# EasyEDA Pro project ProDoc_Board2_2025-10-18.epro

# Schematic Schematic2
Board Name: Board2; Create Date: 2025-10-17; Page Name: P1; Project Name: 日历_2025-10-14_18-41-31; Schematic Name: Schematic2; Update Date: 2025-10-18; Company: 嘉立创EDA; Page Size: B; Version: V1.0
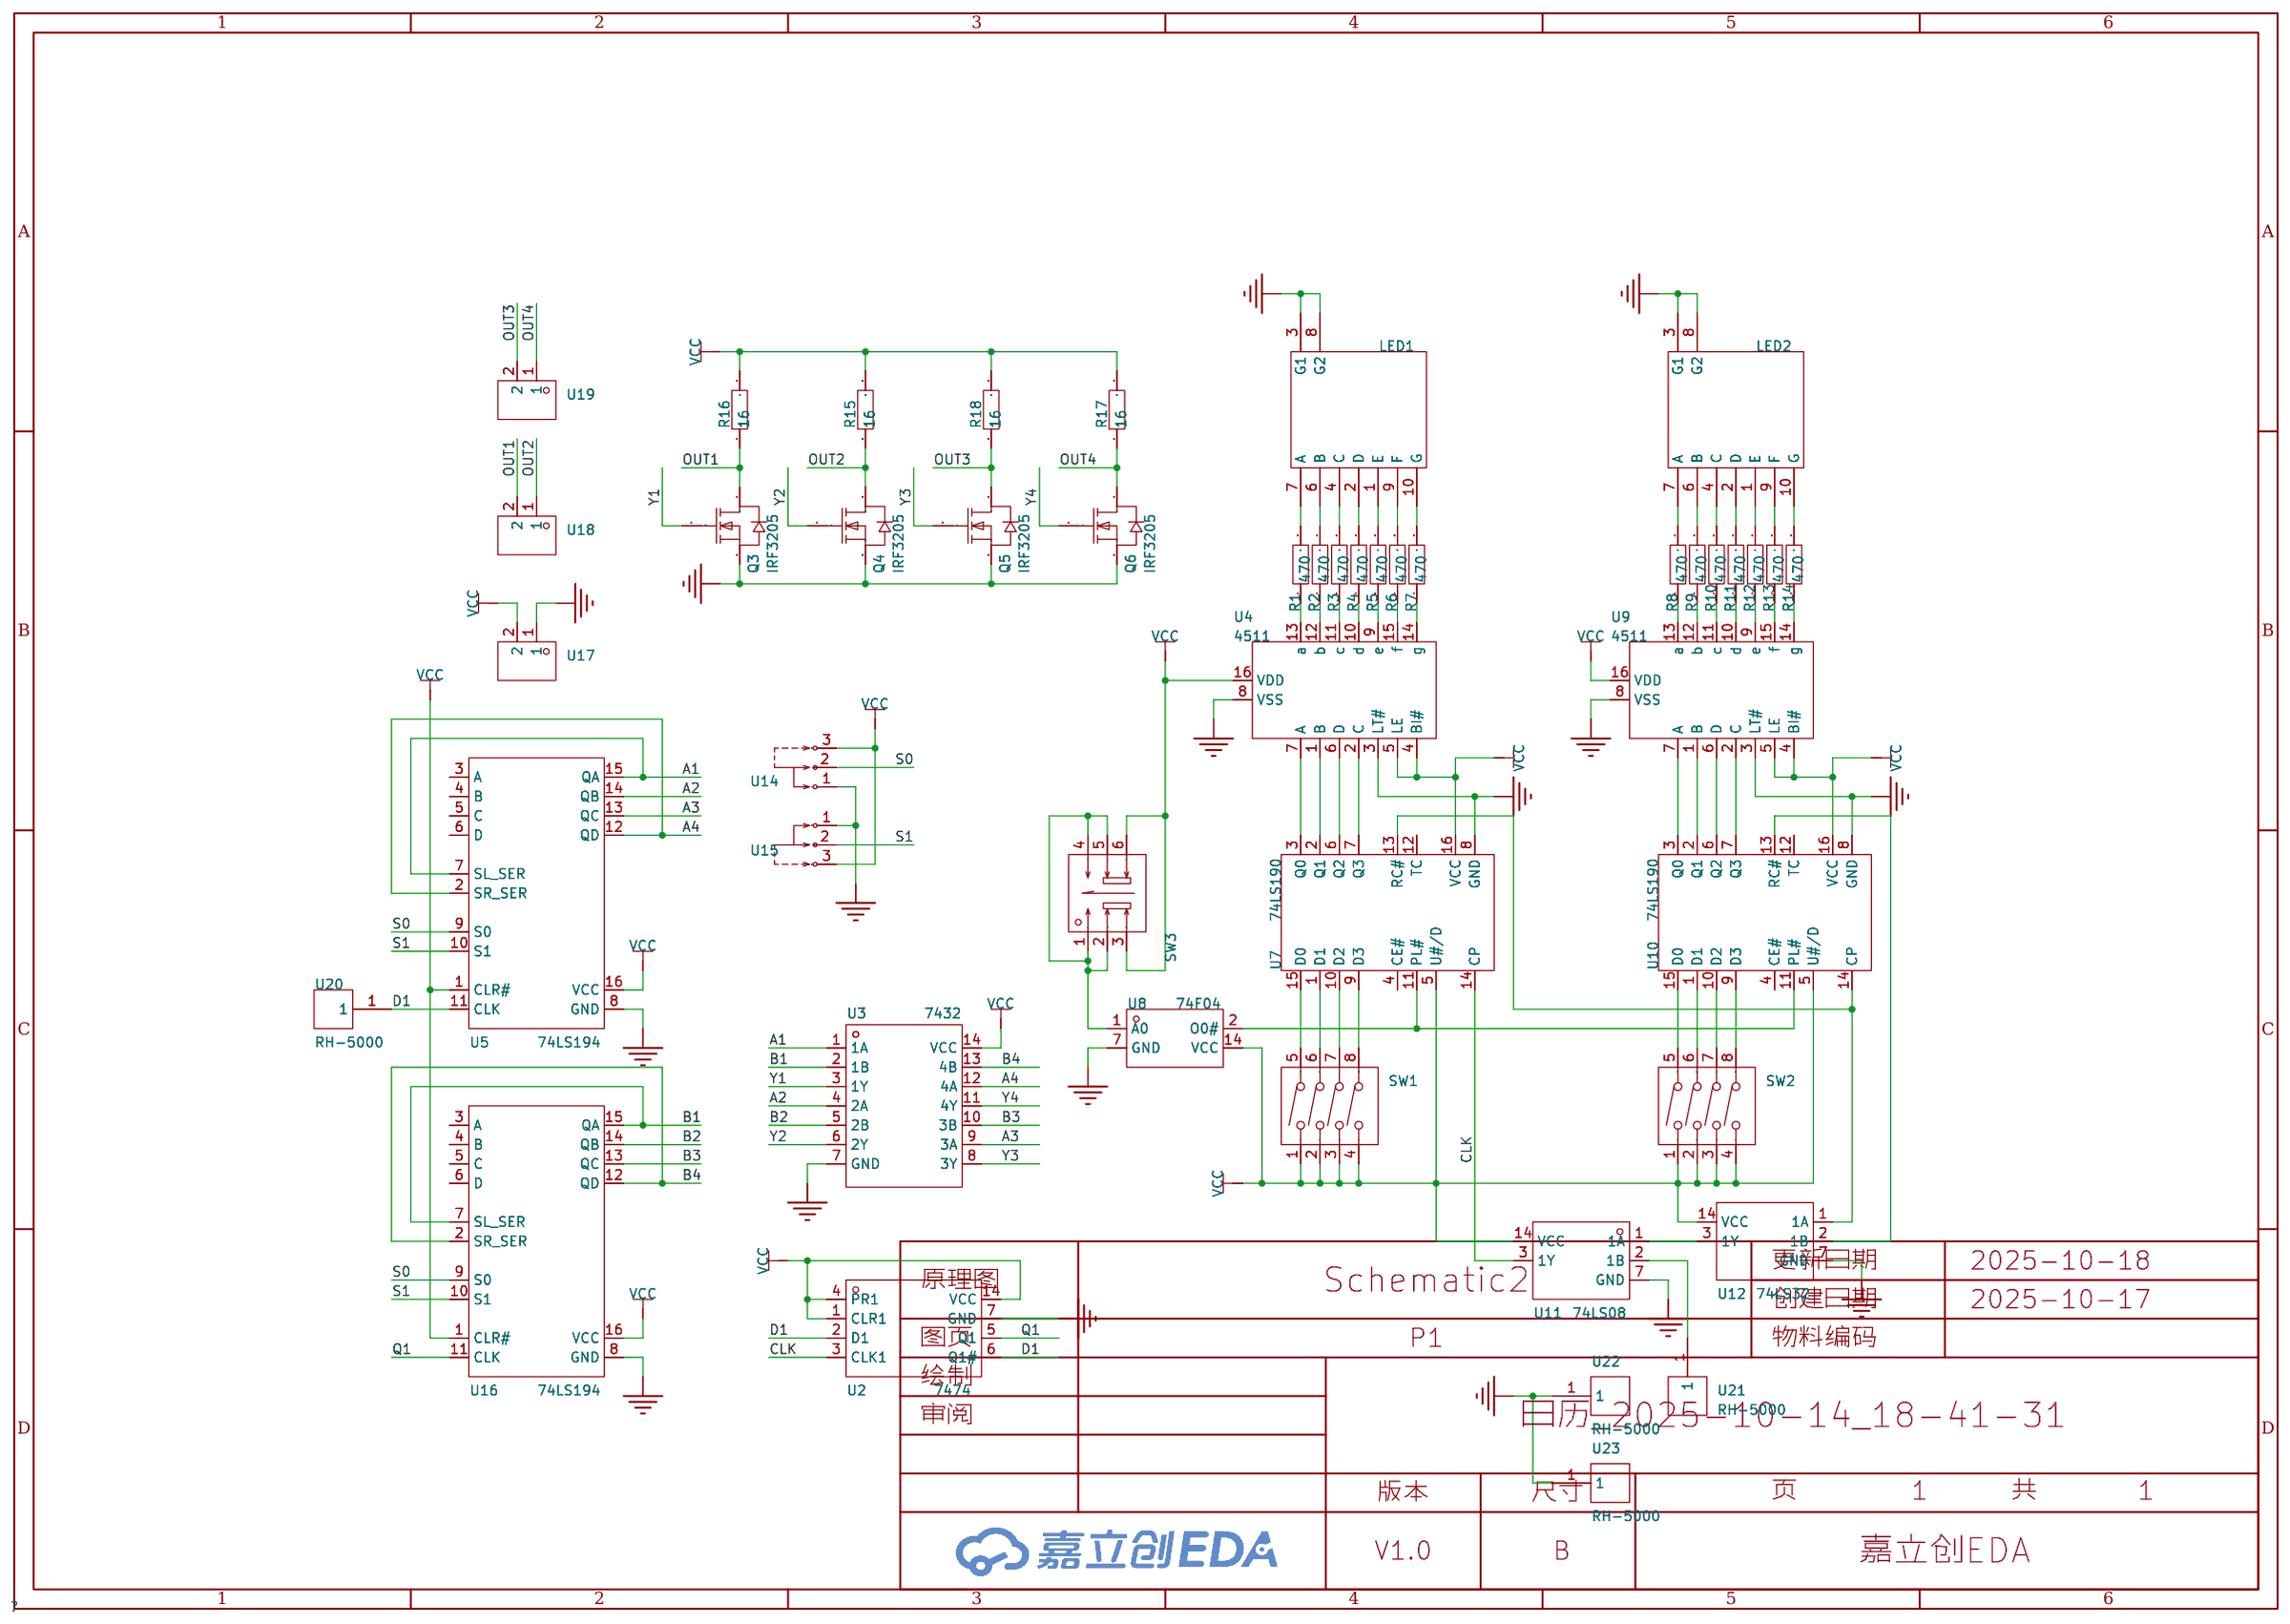
[diagram p0: schematic sheet]

## Parts
LED1  FJ5161AH  [LED-SEG-TH_10P-L12.6-W19.0-P2.54-S15.24-BL]
LED2  FJ5161AH  [LED-SEG-TH_10P-L12.6-W19.0-P2.54-S15.24-BL]
Q3  IRF3205  [TO-220-3_L10.0-W4.5-P2.54-L]
Q4  IRF3205  [TO-220-3_L10.0-W4.5-P2.54-L]
Q5  IRF3205  [TO-220-3_L10.0-W4.5-P2.54-L]
Q6  IRF3205  [TO-220-3_L10.0-W4.5-P2.54-L]
R1  470  [RES-TH_BD2.5-L6.5-P10.50-D0.6]
R2  470  [RES-TH_BD2.5-L6.5-P10.50-D0.6]
R3  470  [RES-TH_BD2.5-L6.5-P10.50-D0.6]
R4  470  [RES-TH_BD2.5-L6.5-P10.50-D0.6]
R5  470  [RES-TH_BD2.5-L6.5-P10.50-D0.6]
R6  470  [RES-TH_BD2.5-L6.5-P10.50-D0.6]
R7  470  [RES-TH_BD2.5-L6.5-P10.50-D0.6]
R8  470  [RES-TH_BD2.5-L6.5-P10.50-D0.6]
R9  470  [RES-TH_BD2.5-L6.5-P10.50-D0.6]
R10  470  [RES-TH_BD2.5-L6.5-P10.50-D0.6]
R11  470  [RES-TH_BD2.5-L6.5-P10.50-D0.6]
R12  470  [RES-TH_BD2.5-L6.5-P10.50-D0.6]
R13  470  [RES-TH_BD2.5-L6.5-P10.50-D0.6]
R14  470  [RES-TH_BD2.5-L6.5-P10.50-D0.6]
R15  16  [RES-TH_BD2.5-L6.5-P10.50-D0.6]
R16  16  [RES-TH_BD2.5-L6.5-P10.50-D0.6]
R17  16  [RES-TH_BD2.5-L6.5-P10.50-D0.6]
R18  16  [RES-TH_BD2.5-L6.5-P10.50-D0.6]
SW1  DSWB04LHGET  [SW-TH_DSWB04LHGET]
SW2  DSWB04LHGET  [SW-TH_DSWB04LHGET]
SW3  5.8 ZSGT  [SW-TH_5.8ZSGT]
U2  7474  [PDIP-14_L19.5-W6.7-P2.54-LS7.9-BL]
U3  7432  [PDIP-14_L19.3-W6.4-P2.54-LS7.6-BL]
U4  4511  [DIP-16_L19.8-W6.5-P2.54-LS7.6-BL]
U5  74LS194  [DIP-16_L19.2-W6.6-P2.54-LS7.6-BL]
U7  74LS190  [PDIP-16_L19.2-W6.6-P2.54-LS7.6-BL]
U8  74F04  [PDIP-14_L19.3-W6.4-P2.54-LS7.9-BL-1]
U9  4511  [DIP-16_L19.8-W6.5-P2.54-LS7.6-BL]
U10  74LS190  [PDIP-16_L19.2-W6.6-P2.54-LS7.6-BL]
U11  74LS08  [PDIP-14_L19.3-W6.4-P2.54-LS7.9-BL-1]
U12  74LS32  [DIP-14_L19.1-W6.4-P2.54-LS7.6-BL]
U14  SS12D10G5  [SW-TH_SHOU-HAN_SS12D10G4]
U15  SS12D10G5  [SW-TH_SHOU-HAN_SS12D10G4]
U16  74LS194  [DIP-16_L19.2-W6.6-P2.54-LS7.6-BL]
U17  DB301V-3.5-2P-GN-S  [CONN-TH_DB301V-3.5-2P-GN]
U18  DB301V-3.5-2P-GN-S  [CONN-TH_DB301V-3.5-2P-GN]
U19  DB301V-3.5-2P-GN-S  [CONN-TH_DB301V-3.5-2P-GN]
U20  RH-5000  [TEST-TH_BD2.54-P1.4_RED]
U21  RH-5000  [TEST-TH_BD2.54-P1.4_RED]
U22  RH-5000  [TEST-TH_BD2.54-P1.4_RED]
U23  RH-5000  [TEST-TH_BD2.54-P1.4_RED]

## Library data of the parts
LED1 LED2 = FJ5161AH: 数码管位数:1位;字符尺寸(英寸):0.56;耗散功率(Pd):-;发光颜色:红色;LED极性:共阴极;; LCSC Part Name: 1位0.56英寸红色数码管 共阴极; Supplier Part: C8093; Manufacturer: 志浩; Supplier Footprint: 插件; JLCPCB Part Class: 扩展库; Datasheet: https://item.szlcsc.com/datasheet/FJ5161AH/8576.html; Supplier: LCSC; Number of Characters: 1位; Digit/Alpha Size(inch): 0.56; Illumination Color: 红色; LED Polarity: 共阴极
Q3-Q6 = IRF3205PBF: 类型:1个N沟道;漏源电压(Vdss):55V;连续漏极电流(Id):110A;导通电阻(RDS(on)@Vgs,Id):8mΩ@10V,62A;功率(Pd):200W;阈值电压(Vgs(th)@Id):4V@250uA;; LCSC Part Name: 1个N沟道 耐压:55V 电流:110A; Supplier Part: C2561; Manufacturer: Infineon(英飞凌); Supplier Footprint: TO-220AB; JLCPCB Part Class: 扩展库; Datasheet: https://atta.szlcsc.com/upload/public/pdf/source/20201126/C2561_C063ADD03C5ACFC796E423BE08ECDD89.pdf; Supplier: LCSC; Type: 1个N沟道; Drain Source Voltage (Vdss): 55V; Continuous Drain Current (Id): 110A; Drain Source On Resistance (RDS(on)@Vgs,Id): 8mΩ@10V,62A; Power Dissipation (Pd): 200W; Gate Threshold Voltage (Vgs(th)@Id): 4V@250uA; Total Gate Charge (Qg@Vgs): 146nC; Input Capacitance (Ciss@Vds): 3.247nF; Reverse Transfer Capacitance (Crss@Vds): 211pF; Operating Temperature: -55℃~+175℃
R1-R18 = MFR0W4F1001A50: 电阻类型:金属膜电阻;阻值:1kΩ;精度:±1%;功率:250mW;温度系数:±50ppm/℃;; LCSC Part Name: 1kΩ ±1% 250mW 金属膜电阻 铜脚，圆柱状直插; Supplier Part: C57435; Manufacturer: UNI-ROYAL(厚声); Supplier Footprint: 插件,D2.2xL6.5mm; JLCPCB Part Class: 扩展库; Datasheet: https://atta.szlcsc.com/upload/public/pdf/source/20191012/C436293_8820AA14BC71FA35E551C06C441482A0.pdf; Supplier: LCSC; Type: 金属膜电阻; Tolerance: ±1%; Voltage-Supply(Max): 250V; Power(Watts): 250mW; Temperature Coefficient: ±50ppm/℃
SW1 SW2 = DSWB04LHGET: 类型:平拨,凸起式;电路结构:单刀单掷;开关位数:4位;工作寿命:-;颜色:红色;; LCSC Part Name: 间距2.54mm 平拨,凸起式 4位拨码开关; Supplier Part: C99418; Manufacturer: YE; Supplier Footprint: 插件; JLCPCB Part Class: 扩展库; Datasheet: https://item.szlcsc.com/datasheet/DSWB04LHGET/100632.html; Supplier: LCSC; Type: 平拨,凸起式; Circuit: 单刀单掷; Number of Positions: 4位; Lead Pitch: 2.54mm; Color: 红色
SW3 = 5.8 ZSGT: 电路结构:双刀双掷;自锁/无锁:自锁;安装方式:直插;触点电流:110mA;额定电压:30V;带灯:不带;作用力:1.5N;工作寿命:10万次;; LCSC Part Name: 5.8*5.8有头/高头 带锁/自锁开关 泡泡机开关; Supplier Part: C2681587; Manufacturer: SHOU HAN(首韩); Supplier Footprint: 插件; JLCPCB Part Class: 扩展库; Datasheet: https://item.szlcsc.com/datasheet/5.8%2520ZSGT/2774930.html; Supplier: LCSC; Circuit: 双刀双掷; Self Lock / No Lock: 自锁; Actuator Style: 方形按钮; Mounting Type: 直插; Contact Current: 110mA; Voltage Rating: 30V; Actuator/Cap Color: 白色; With Lamp: 不带; Termination Style: PC引脚; Operating Force: 1.5N; Operating Temperature: -10℃~+70℃; Life: 10万次
U2 = DM7474N: 类型:D-型;电源电压:4.75V~5.25V;时钟频率:15MHz;元件数:2;每个元件位数:1;最大传播延迟:40ns@5V,15pF;静态电流(Iq):30mA;; Supplier Part: C3827260; Manufacturer: TI(德州仪器); Supplier Footprint: PDIP-14; JLCPCB Part Class: 扩展库; Datasheet: https://atta.szlcsc.com/upload/public/pdf/source/20230915/F50CE702BE5FBF5B3D20FC95F075EAF5.pdf; Supplier: LCSC; Type: D-型; Trigger Type: 上升沿; Supply Voltage: 4.75V~5.25V; Clock Frequency: 15MHz; Function: 置位和复位; Number of Elements: 2; Number of Bits per Element: 1; Output Type: 互补型; Maximum Propagation Delay: 40ns@5V,15pF; Series: 7400系列; Sink Current: 16mA; Source Current: 400uA; Quiescent Current (Iq): 30mA; Operating Temperature: 0℃~+70℃
U3 = SN7432N: 逻辑类型:或门;通道数:4;电源电压:4.75V~5.25V;静态电流(最大值):22mA;最大传播延迟:22ns@5V,15pF;; Supplier Part: C2869693; Manufacturer: TI(德州仪器); Supplier Footprint: PDIP-14; JLCPCB Part Class: 扩展库; Datasheet: https://www.ti.com/cn/lit/gpn/sn74ls32; Supplier: LCSC; Logic Gate Type: 或门; Number of Channels: 4; Supply Voltage: 4.75V~5.25V; Quiescent Current (Max): 22mA; Sink Current: 16mA; Source Current: 800uA; High Level Range (VIH): 2V; Low Level Range (VIL): 800mV; Series: 7400系列; Propagation Delay Time: 22ns@5V,15pF; Operating Temperature: 0℃~+70℃
U4 U9 = CD4511BE: 工作电压:-;灌电流(IOL):-;拉电流(IOH):-;; Supplier Part: C5145431; Manufacturer: HGC(深圳汉芯); Supplier: LCSC
U5 U16 = XD74LS194: 功能:-;; Supplier Part: C609770; Manufacturer: XINLUDA(信路达); Supplier Footprint: DIP-16; JLCPCB Part Class: 扩展库; Datasheet: https://atta.szlcsc.com/upload/public/pdf/source/20240819/BACA8CA24B248C94286CC5B3E93B748D.pdf; Supplier: LCSC
U7 U10 = SN74LS190N(XBLW): 工作电压:-;元件数:1;触发沿:-;计数速率:28MHz;; LCSC Part Name: SN74LS190是一个异步预设的上/下BCD十进制计数器。; Supplier Part: C42451383; Manufacturer: XBLW(芯伯乐); Supplier Footprint: DIP-16; JLCPCB Part Class: 扩展库; Datasheet: https://item.szlcsc.com/datasheet/SN74LS190N(XBLW)/44513581.html; Supplier: LCSC; Number of Elements: 1; Count Rate: 28MHz; Operating Temperature: -20℃~+85℃
U8 = 74F04PC_C3272304: 电源电压:4.5V~5.5V;供电电流(最大值):15.3mA;电路数:6;最大传播延迟(tpd):5ns@5V,50pF;; LCSC Part Name: 74F04PC; Supplier Part: C3272304; Manufacturer: TI(德州仪器); Supplier Footprint: DIP-14; JLCPCB Part Class: 扩展库; Datasheet: https://atta.szlcsc.com/upload/public/pdf/source/20230915/D34AD1868F1EECB342D065CA48E72754.pdf; Supplier: LCSC; Supply Voltage(Single): 4.5V~5.5V; Supply Current (Max): 15.3mA; Number of Circuits: 6; Number of Inputs: 1; Sink Current: 20mA; Source Current: 1mA; High level range (VIH): 2V; Low level range (VIL): 800mV; Max Propagation Delay: 5ns@5V,50pF; Series: 74F系列; Operating Temperature: 0℃~+70℃
U11 = SN74LS08N: 逻辑类型:与门;通道数:4;工作电压:4.75V~5.25V;传播延迟(tpd):-;; Supplier Part: C2869595; Manufacturer: TI(德州仪器); Supplier Footprint: PDIP-14; JLCPCB Part Class: 扩展库; Datasheet: https://www.ti.com/cn/lit/gpn/sn54s08; Supplier: LCSC; Logic Type: 与门; Number of Channels: 4; Voltage - Supply: 4.75V~5.25V; Current - Output Low(IOL): 8mA; Current - Output High(IOH): 400uA; Input Logic Level - High: 2V; Input Logic Level - Low: 800mV; Series: 74LS系列; Operating Temperature: 0℃~+70℃
U12 = SN74LS32N(LX): 逻辑类型:或门;通道数:4;工作电压:2V~6V;静态电流(Iq):2uA;传播延迟(tpd):15ns@6V,15pF;; LCSC Part Name: 4路2输入或门; Supplier Part: C22466295; Manufacturer: LX(灵星芯微); Supplier Footprint: DIP-14; JLCPCB Part Class: 扩展库; Datasheet: https://item.szlcsc.com/datasheet/SN74LS32N(LX)/24165305.html; Supplier: LCSC; Logic Type: 或门; Number of Channels: 4; Voltage - Supply: 2V~6V; Quiescent Current: 2uA; Current - Output Low(IOL): 5.2mA; Input Logic Level - Low: 800mV~2.8V; Output Logic Level - High: 1.9V~5.48V; Output Logic Level - Low: 100mV~260mV; Series: 74LS系列; Propagation Delay: 15ns@6V,15pF; Operating Temperature: -40℃~+125℃
U14 U15 = SS12D10G5: 电路结构:单刀双掷;安装方式:直插;额定电流:2A;额定电压:125V;工作寿命:3千次;; LCSC Part Name: 两档立式插件 3脚拨动开关 柄长5.0mm; Supplier Part: C7431054; Manufacturer: SHOU HAN(首韩); Supplier Footprint: 插件,12.7x6.7mm; JLCPCB Part Class: 扩展库; Datasheet: https://item.szlcsc.com/datasheet/SS12D10G5/8431406.html; Supplier: LCSC; Circuit: 单刀双掷; Length: 12.7mm; Width: 6.7mm; Mounting Type: 直插; Current Rating: 2A; Voltage Rating: 125V; Life: 3千次; Operating Temperature: -25℃~+70℃
U17-U19 = DB301V-3.5-2P-GN-S: 结构:1x2P;间距:3.5mm;颜色:绿色;安装方式:直插;排数:1;每排PIN数:2;额定电流:7A;额定电压:300V;线规 - AWG:-;线规 - 平方毫米:-;工作温度:-40℃~+105℃;; LCSC Part Name: 1x2P 3.5mm 直插 排数:1 每排P数:2; Supplier Part: C695629; Manufacturer: DORABO(地博电气); Supplier Footprint: 插件,P=3.5mm; JLCPCB Part Class: 扩展库; Datasheet: https://item.szlcsc.com/datasheet/DB301V-3.5-2P-GN-S/728965.html; Supplier: LCSC; Number of Positions or Pins: 1x2P; Pitch: 3.5mm; Color: 绿色; Mounting Type: 直插; Number of Pins: 2P; Number of Rows: 1; Number of PINs Per Row: 2; Screw Specification: M2; Current Rating: 7A; Voltage Rating (Max): 300V; Operating Temperature: -40℃~+105℃
U20-U23 = RH-5000: LCSC Part Name: PCB电路板测试点/测试针; Supplier Part: C5277086; Manufacturer: 荣和; JLCPCB Part Class: 扩展库; Datasheet: https://atta.szlcsc.com/upload/public/pdf/source/20230704/1671C2774A3D6CEDC1FD6AAF48538C87.pdf; Supplier: LCSC

## Nets
GND: LED1.3(G1) LED1.8(G2) LED2.3(G1) LED2.8(G2) Q3.3(S) Q4.3(S) Q5.3(S) Q6.3(S) U2.7(GND) U3.7(GND) U4.3(LT#) U4.8(VSS) U5.8(GND) U7.8(GND) U8.7(GND) U9.3(LT#) U9.8(VSS) U10.8(GND) U11.7(GND) U12.7(GND) U14.1 U15.1 U16.8(GND) U17.1 U22.1 U23.1
VCC: R15.2 R16.2 R17.2 R18.2 SW1.1 SW1.2 SW1.3 SW1.4 SW2.1 SW2.2 SW2.3 SW2.4 SW3.3 SW3.6 U2.1(CLR1) U2.4(PR1) U2.14(VCC) U3.14(VCC) U4.4(BI#) U4.5(LE) U4.16(VDD) U5.1(CLR#) U5.16(VCC) U7.5(U#/D) U7.16(VCC) U8.14(VCC) U9.4(BI#) U9.5(LE) U9.16(VDD) U10.5(U#/D) U10.16(VCC) U11.14(VCC) U12.14(VCC) U14.3 U15.3 U16.1(CLR#) U16.16(VCC) U17.2
A1: U3.1(1A) U5.7(SL SER) U5.15(QA)
A2: U3.4(2A) U5.14(QB)
A3: U3.9(3A) U5.13(QC)
A4: U3.12(4A) U5.2(SR SER) U5.12(QD)
B1: U3.2(1B) U16.7(SL SER) U16.15(QA)
B2: U3.5(2B) U16.14(QB)
B3: U3.10(3B) U16.13(QC)
B4: U3.13(4B) U16.2(SR SER) U16.12(QD)
CLK: U2.3(CLK1) U7.14(CP) U11.3(1Y)
D1: U2.2(D1) U2.6(Q1#) U5.11(CLK) U20.1
OUT1: Q3.2(D) R16.1 U18.2
OUT2: Q4.2(D) R15.1 U18.1
OUT3: Q5.2(D) R18.1 U19.2
OUT4: Q6.2(D) R17.1 U19.1
Q1: U2.5(Q1) U16.11(CLK)
S0: U5.9(S0) U14.2 U16.9(S0)
S1: U5.10(S1) U15.2 U16.10(S1)
Y1: Q3.1(G) U3.3(1Y)
Y2: Q4.1(G) U3.6(2Y)
Y3: Q5.1(G) U3.8(3Y)
Y4: Q6.1(G) U3.11(4Y)
$1N3492: LED1.7(A) R1.2
$1N3494: LED1.1(E) R5.2
$1N3496: LED1.2(D) R4.2
$1N3498: LED1.4(C) R3.2
$1N3500: LED1.6(B) R2.2
$1N3502: LED1.9(F) R6.2
$1N3504: LED1.10(G) R7.2
$1N3506: R1.1 U4.13(a)
$1N3508: R5.1 U4.9(e)
$1N3510: R4.1 U4.10(d)
$1N3512: R3.1 U4.11(c)
$1N3514: R2.1 U4.12(b)
$1N3516: R7.1 U4.14(g)
$1N3518: R6.1 U4.15(f)
$1N4737: U4.2(C) U7.7(Q3)
$1N4741: U4.6(D) U7.6(Q2)
$1N4746: U4.1(B) U7.2(Q1)
$1N4751: U4.7(A) U7.3(Q0)
$1N5070: U7.11(PL#) U8.2(O0#) U10.11(PL#)
$1N5072: SW1.6 U7.1(D1)
$1N5074: SW1.8 U7.9(D3)
$1N5076: SW1.7 U7.10(D2)
$1N5078: SW1.5 U7.15(D0)
$1N5761: R13.1 U9.15(f)
$1N5762: R14.1 U9.14(g)
$1N5763: R12.1 U9.9(e)
$1N5764: R10.1 U9.11(c)
$1N5765: R11.1 U9.10(d)
$1N5766: R9.1 U9.12(b)
$1N5767: R8.1 U9.13(a)
$1N5768: LED2.9(F) R13.2
$1N5769: LED2.10(G) R14.2
$1N5770: LED2.1(E) R12.2
$1N5771: LED2.2(D) R11.2
$1N5772: LED2.4(C) R10.2
$1N5773: LED2.7(A) R8.2
$1N5774: LED2.6(B) R9.2
$1N5787: SW2.8 U10.9(D3)
$1N5789: SW2.5 U10.15(D0)
$1N5791: SW2.6 U10.1(D1)
$1N5793: SW2.7 U10.10(D2)
$1N5811: U10.13(RC#) U12.2(1B)
$1N5814: U9.7(A) U10.3(Q0)
$1N5816: U9.1(B) U10.2(Q1)
$1N5818: U9.6(D) U10.6(Q2)
$1N5820: U9.2(C) U10.7(Q3)
$1N6469: U7.13(RC#) U10.14(CP) U12.1(1A)
$1N7655: U11.1(1A) U12.3(1Y)
$1N11028: SW3.1 SW3.2 SW3.4 SW3.5 U8.1(A0)
Net-(U11-2): U11.2(1B) U21.1

Not connected (* = marked no-connect by the designer): U5 3(A) 4(B) 5(C) 6(D); U7 4(CE#) 12(TC); U10 4(CE#) 12(TC); U16 3(A) 4(B) 5(C) 6(D)

# Board PCB3
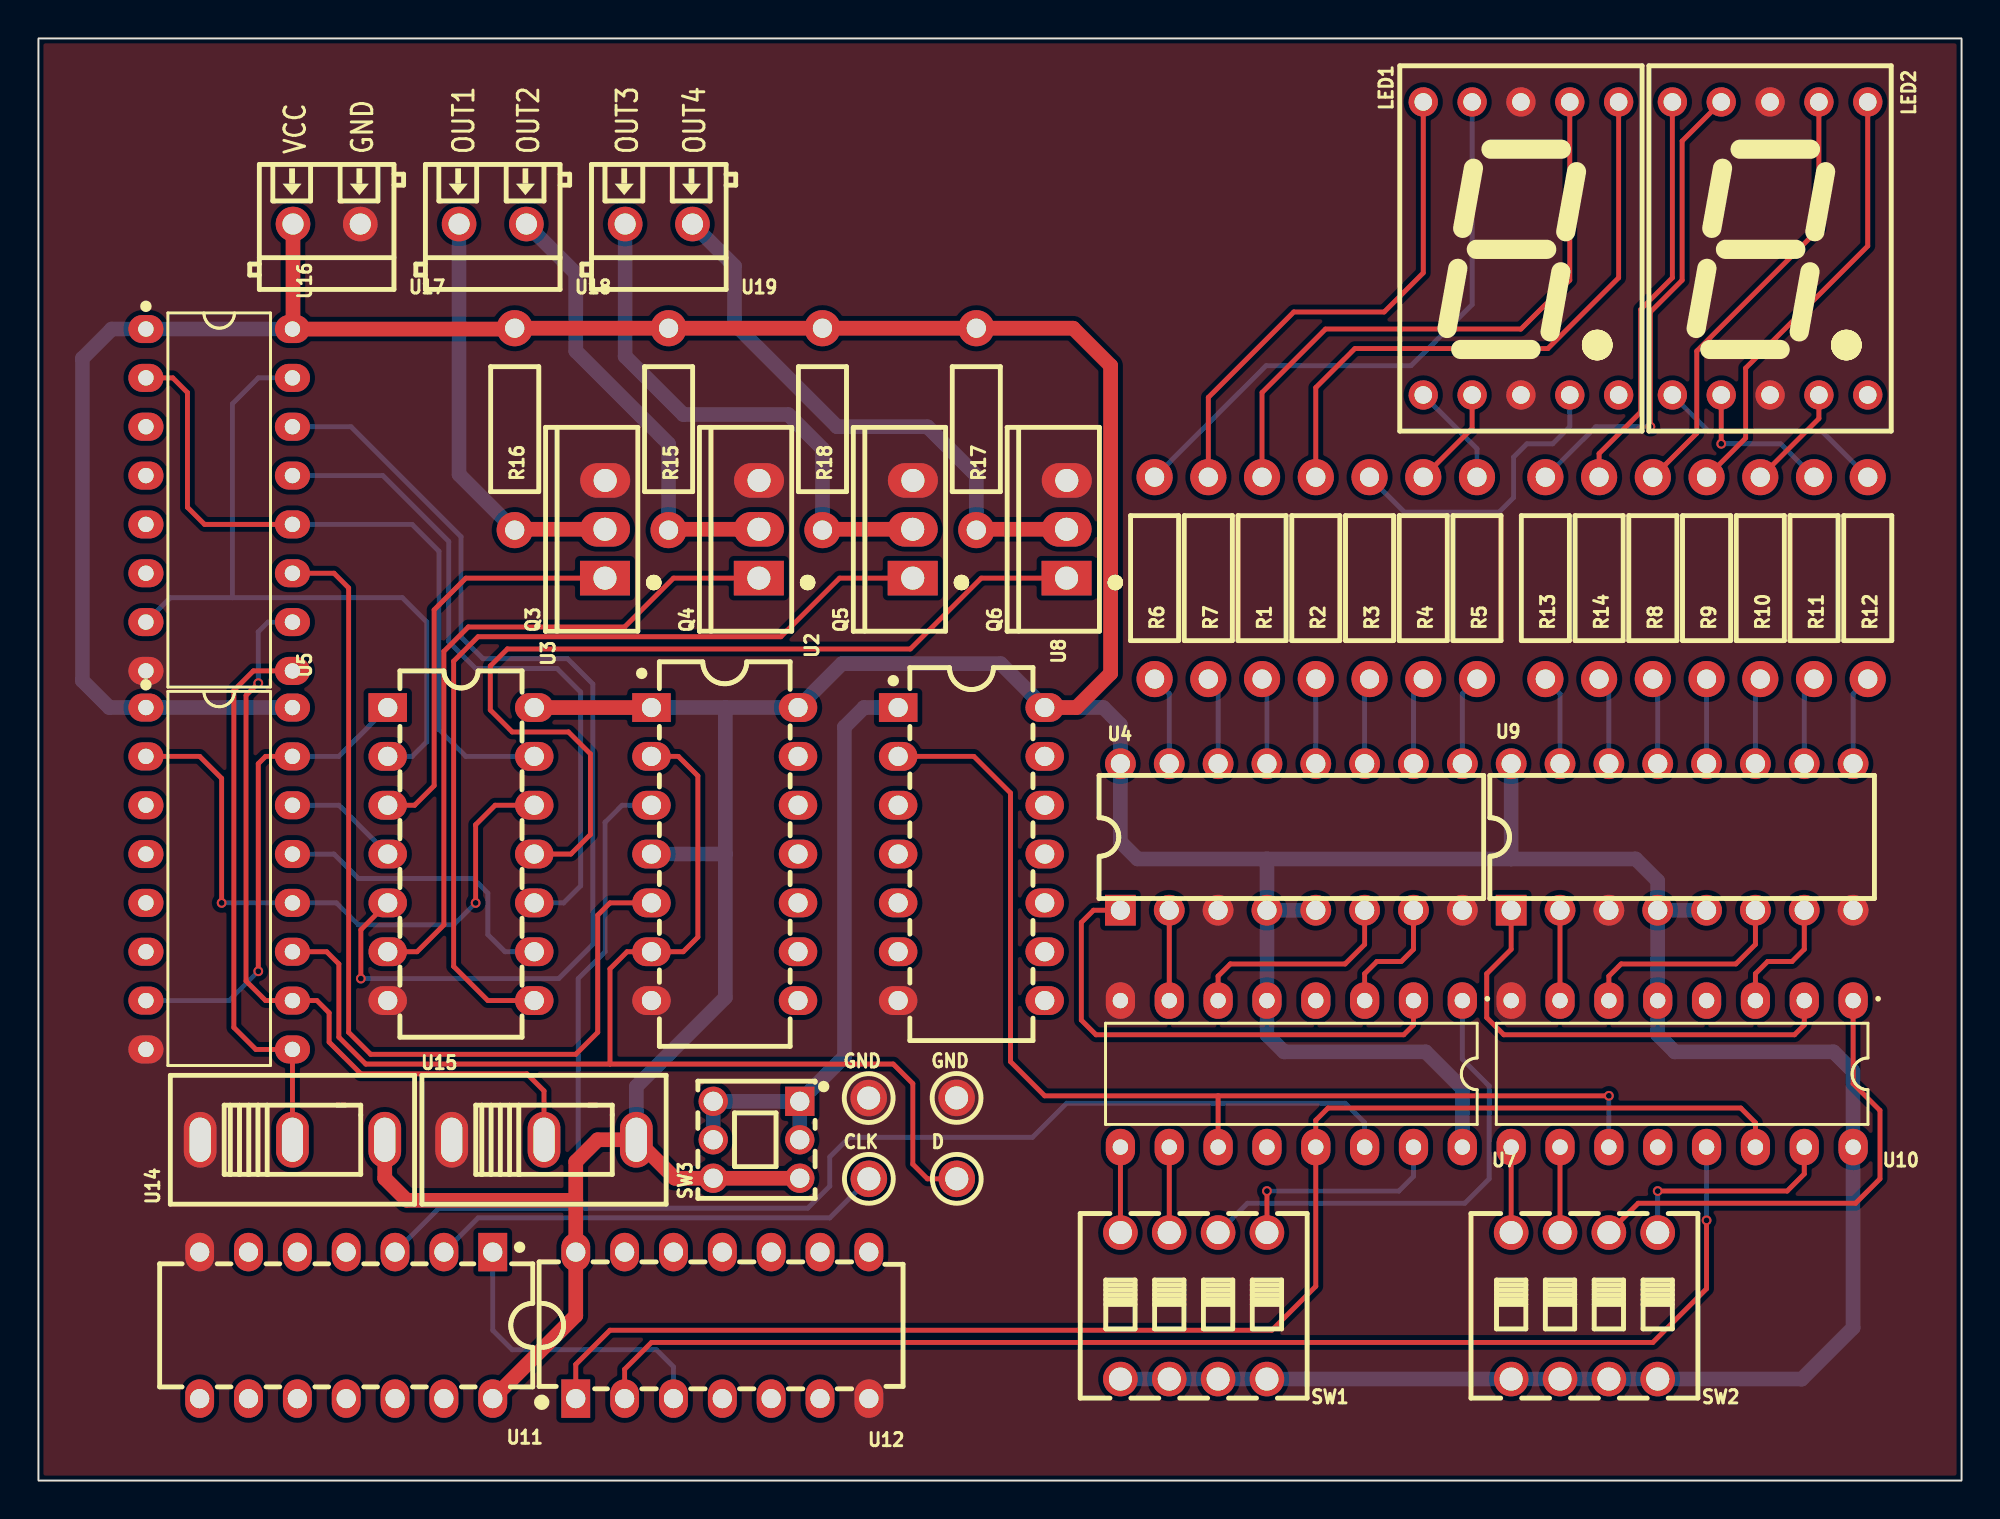
[diagram p1: board, top side]
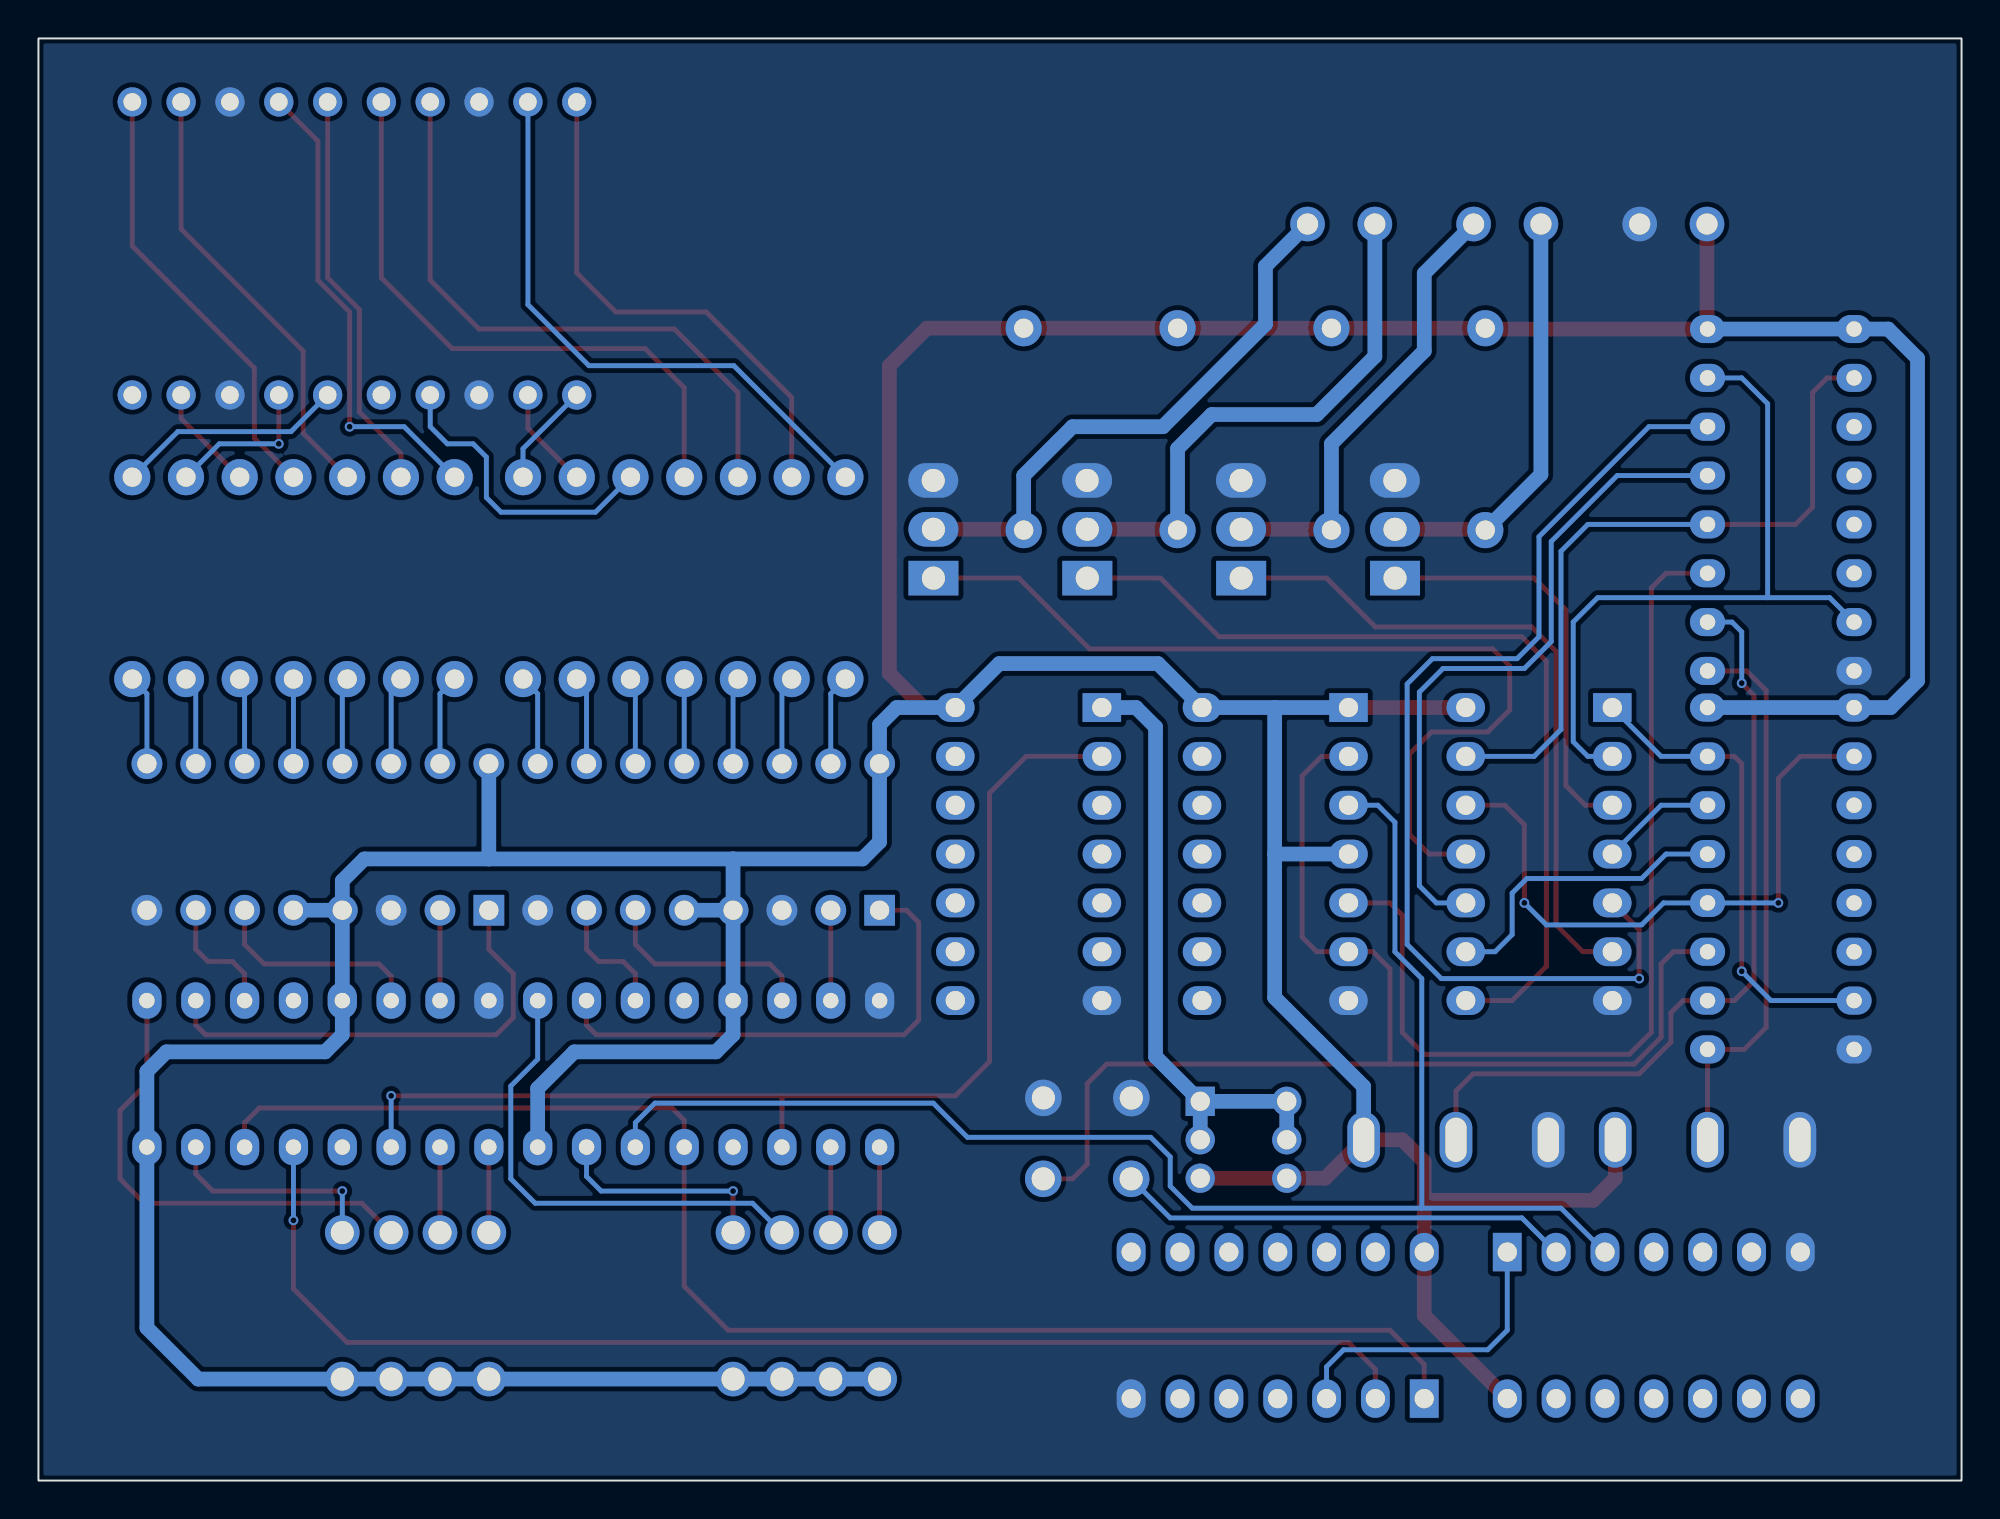
[diagram p2: board, bottom side, seen from below]

Outline 100 x 75 mm; copper layers: Top Layer, Bottom Layer. Coordinates in mm from the lower left corner of the outline.
Outline path: rectangle 0,75 100,0
Stack: Top Layer 0.035mm / Dielectric1 1.51mm FR4 er 4.5 / Bottom Layer 0.035mm

## Design rules (mm)
template: 自定义配置
spacing copperThickness1oz (default): track to track 0.102, other pairs 0.152 to 0.3
spacing copperThickness2oz: track to track 0.203, other pairs 0.152 to 0.3
track width copperThickness1oz (default): min 0.127, default 0.254, max 2.54
track width copperThickness2oz: min 0.203, default 0.254, max 2.54
differential pair differentialPair (default): width min 0.127, default 0.254, max 2.54; gap min 0.152, default 0.152
via viaSize (default): diameter min 0.5, default 0.61, max 10; hole min 0.3, default 0.305, max 6.3

## Placement (name value [footprint] x y rotation side)
CLK  RH-5000  [TEST-TH_BD2.54-P1.4_RED]  43.18 15.69 0 top
D  RH-5000  [TEST-TH_BD2.54-P1.4_RED]  47.75 15.69 0 top
GND  -  [TEST-TH_BD2.54-P1.4_RED]  43.17 19.89 0 top
GND#2  -  [TEST-TH_BD2.54-P1.4_RED]  47.74 19.9 0 top
LED1  FJ5161AH  [LED-SEG-TH_10P-L12.6-W19.0-P2.54-S15.24-BL]  77.09 64.08 0 top
LED2  FJ5161AH  [LED-SEG-TH_10P-L12.6-W19.0-P2.54-S15.24-BL]  90.04 64.08 0 top
Q3  IRF3205  [TO-220-3_L10.0-W4.5-P2.54-L]  29.46 49.47 90 top
Q4  IRF3205  [TO-220-3_L10.0-W4.5-P2.54-L]  37.47 49.47 90 top
Q5  IRF3205  [TO-220-3_L10.0-W4.5-P2.54-L]  45.47 49.47 90 top
Q6  IRF3205  [TO-220-3_L10.0-W4.5-P2.54-L]  53.47 49.47 90 top
R1  470  [RES-TH_BD2.5-L6.5-P10.50-D0.6]  63.63 46.93 90 top
R2  470  [RES-TH_BD2.5-L6.5-P10.50-D0.6]  66.42 46.93 90 top
R3  470  [RES-TH_BD2.5-L6.5-P10.50-D0.6]  69.22 46.93 90 top
R4  470  [RES-TH_BD2.5-L6.5-P10.50-D0.6]  72.01 46.93 90 top
R5  470  [RES-TH_BD2.5-L6.5-P10.50-D0.6]  74.8 46.93 90 top
R6  470  [RES-TH_BD2.5-L6.5-P10.50-D0.6]  58.04 46.93 90 top
R7  470  [RES-TH_BD2.5-L6.5-P10.50-D0.6]  60.83 46.93 90 top
R8  470  [RES-TH_BD2.5-L6.5-P10.50-D0.6]  83.95 46.93 90 top
R9  470  [RES-TH_BD2.5-L6.5-P10.50-D0.6]  86.74 46.93 90 top
R10  470  [RES-TH_BD2.5-L6.5-P10.50-D0.6]  89.53 46.93 90 top
R11  470  [RES-TH_BD2.5-L6.5-P10.50-D0.6]  92.33 46.93 90 top
R12  470  [RES-TH_BD2.5-L6.5-P10.50-D0.6]  95.12 46.93 90 top
R13  470  [RES-TH_BD2.5-L6.5-P10.50-D0.6]  78.36 46.93 90 top
R14  470  [RES-TH_BD2.5-L6.5-P10.50-D0.6]  81.15 46.93 90 top
R15  16  [RES-TH_BD2.5-L6.5-P10.50-D0.6]  32.77 54.68 90 top
R16  16  [RES-TH_BD2.5-L6.5-P10.50-D0.6]  24.77 54.68 90 top
R17  16  [RES-TH_BD2.5-L6.5-P10.50-D0.6]  48.77 54.68 90 top
R18  16  [RES-TH_BD2.5-L6.5-P10.50-D0.6]  40.77 54.68 90 top
SW1  DSWB04LHGET  [SW-TH_DSWB04LHGET]  60.07 9.09 180 top
SW2  DSWB04LHGET  [SW-TH_DSWB04LHGET]  80.39 9.09 180 top
SW3  5.8 ZSGT  [SW-TH_5.8ZSGT]  37.34 17.72 90 top
U2  7474  [PDIP-14_L19.5-W6.7-P2.54-LS7.9-BL]  35.69 32.58 270 top
U3  7432  [PDIP-14_L19.3-W6.4-P2.54-LS7.6-BL]  21.97 32.58 270 top
U4  4511  [DIP-16_L19.8-W6.5-P2.54-LS7.6-BL]  65.15 33.47 0 top
U5  74LS194  [DIP-16_L19.2-W6.6-P2.54-LS7.6-BL]  9.4 31.31 270 top
U7  74LS190  [PDIP-16_L19.2-W6.6-P2.54-LS7.6-BL]  65.15 21.15 180 top
U8  74F04  [PDIP-14_L19.3-W6.4-P2.54-LS7.9-BL-1]  48.51 32.58 270 top
U9  4511  [DIP-16_L19.8-W6.5-P2.54-LS7.6-BL]  85.47 33.47 0 top
U10  74LS190  [PDIP-16_L19.2-W6.6-P2.54-LS7.6-BL]  85.47 21.15 180 top
U11  74LS08  [PDIP-14_L19.3-W6.4-P2.54-LS7.9-BL-1]  16 8.07 180 top
U12  74LS32  [DIP-14_L19.1-W6.4-P2.54-LS7.6-BL]  35.56 8.07 0 top
U14  SS12D10G5  [SW-TH_SHOU-HAN_SS12D10G4]  13.21 17.72 0 top
U15  SS12D10G5  [SW-TH_SHOU-HAN_SS12D10G4]  26.29 17.72 0 top
U16  74LS194  [DIP-16_L19.2-W6.6-P2.54-LS7.6-BL]  9.4 51 270 top
U17  DB301V-3.5-2P-GN-S  [CONN-TH_DB301V-3.5-2P-GN]  14.99 65.35 180 top
U18  DB301V-3.5-2P-GN-S  [CONN-TH_DB301V-3.5-2P-GN]  23.62 65.35 180 top
U19  DB301V-3.5-2P-GN-S  [CONN-TH_DB301V-3.5-2P-GN]  32.26 65.35 180 top

## Footprints (pads in the part's own frame, mm; a bottom-side part is the same pattern mirrored in y, then rotated)
CONN-TH_DB301V-3.5-2P-GN
  round 1.8 hole 1.1: 1(-1.75,0) 2(1.75,0)
DIP-14_L19.1-W6.4-P2.54-LS7.6-BL
  rect 1.5x2 hole 1: 1(-7.62,-3.81)
  oval 1.5x2 hole 1: 2(-5.08,-3.81) 3(-2.54,-3.81) 4(0,-3.81) 5(2.54,-3.81) 6(5.08,-3.81) 7(7.62,-3.81) 8(7.62,3.81) 9(5.08,3.81) 10(2.54,3.81) 11(0,3.81) 12(-2.54,3.81) 13(-5.08,3.81) 14(-7.62,3.81)
DIP-16_L19.2-W6.6-P2.54-LS7.6-BL
  oval 1.46x1.825 hole 0.8: 1(-8.89,-3.81) 2(-6.35,-3.81) 3(-3.81,-3.81) 4(-1.27,-3.81) 5(1.27,-3.81) 6(3.81,-3.81) 7(6.35,-3.81) 8(8.89,-3.81) 9(8.89,3.81) 10(6.35,3.81) 11(3.81,3.81) 12(1.27,3.81) 13(-1.27,3.81) 14(-3.81,3.81) 15(-6.35,3.81) 16(-8.89,3.81)
DIP-16_L19.8-W6.5-P2.54-LS7.6-BL
  rect 1.6x1.6 hole 1: 1(-8.89,-3.81)
  round 1.6 hole 1: 2(-6.35,-3.81) 3(-3.81,-3.81) 4(-1.27,-3.81) 5(1.27,-3.81) 6(3.81,-3.81) 7(6.35,-3.81) 8(8.89,-3.81) 9(8.89,3.81) 10(6.35,3.81) 11(3.81,3.81) 12(1.27,3.81) 13(-1.27,3.81) 14(-3.81,3.81) 15(-6.35,3.81) 16(-8.89,3.81)
LED-SEG-TH_10P-L12.6-W19.0-P2.54-S15.24-BL
  round 1.524 hole 0.914: 1(-5.08,-7.62) 2(-2.54,-7.62) 3(0,-7.62) 4(2.54,-7.62) 5(5.08,-7.62) 6(5.08,7.62) 7(2.54,7.62) 8(0,7.62) 9(-2.54,7.62) 10(-5.08,7.62)
PDIP-14_L19.3-W6.4-P2.54-LS7.6-BL
  rect 1.5x2 hole 1: 1(-7.62,-3.81)
  oval 1.5x2 hole 1: 2(-5.08,-3.81) 3(-2.54,-3.81) 4(0,-3.81) 5(2.54,-3.81) 6(5.08,-3.81) 7(7.62,-3.81) 8(7.62,3.81) 9(5.08,3.81) 10(2.54,3.81) 11(0,3.81) 12(-2.54,3.81) 13(-5.08,3.81) 14(-7.62,3.81)
PDIP-14_L19.3-W6.4-P2.54-LS7.9-BL-1
  rect 1.5x2 hole 1: 1(-7.62,-3.809)
  oval 1.5x2 hole 1: 2(-5.08,-3.81) 3(-2.54,-3.81) 4(0,-3.81) 5(2.54,-3.81) 6(5.08,-3.81) 7(7.62,-3.81) 8(7.62,3.81) 9(5.08,3.81) 10(2.54,3.81) 11(0,3.81) 12(-2.54,3.81) 13(-5.08,3.81) 14(-7.62,3.81)
PDIP-14_L19.5-W6.7-P2.54-LS7.9-BL
  rect 1.5x2 hole 1: 1(-7.62,-3.809)
  oval 1.5x2 hole 1: 2(-5.08,-3.81) 3(-2.54,-3.81) 4(0,-3.81) 5(2.54,-3.81) 6(5.08,-3.81) 7(7.62,-3.81) 8(7.62,3.81) 9(5.08,3.81) 10(2.54,3.81) 11(0,3.81) 12(-2.54,3.81) 13(-5.08,3.81) 14(-7.62,3.81)
PDIP-16_L19.2-W6.6-P2.54-LS7.6-BL
  oval 1.52x1.9 hole 0.8: 1(-8.89,-3.81) 2(-6.35,-3.81) 3(-3.81,-3.81) 4(-1.27,-3.81) 5(1.27,-3.81) 6(3.81,-3.81) 7(6.35,-3.81) 8(8.89,-3.81) 9(8.89,3.81) 10(6.35,3.81) 11(3.81,3.81) 12(1.27,3.81) 13(-1.27,3.81) 14(-3.81,3.81) 15(-6.35,3.81) 16(-8.89,3.81)
RES-TH_BD2.5-L6.5-P10.50-D0.6
  round 1.879 hole 1: 1(-5.25,0) 2(5.25,0)
SW-TH_5.8ZSGT
  rect 1.524x1.524 hole 1: 1(2,-2.25)
  round 1.524 hole 1: 2(0,-2.25) 3(-2,-2.25) 4(2,2.25) 5(0,2.25) 6(-2,2.25)
SW-TH_DSWB04LHGET
  round 1.8 hole 1.2: 1(-3.81,3.81) 2(-1.27,3.81) 3(1.27,3.81) 4(3.81,3.81) 5(-3.81,-3.81) 6(-1.27,-3.81) 7(1.27,-3.81) 8(3.81,-3.81)
SW-TH_SHOU-HAN_SS12D10G4
  oval 1.7x2.9 hole 1.1x2.3: 1(-4.8,0) 2(0,0) 3(4.8,0)
TEST-TH_BD2.54-P1.4_RED
  round 1.9 hole 1.2: 1(0,0)
TO-220-3_L10.0-W4.5-P2.54-L
  rect 1.8x2.6 hole 1.2: 1(-2.54,0.005)
  oval 1.8x2.6 hole 1.2: 2(0,0.005) 3(2.54,-0.005)

## Nets
As in the schematic, except:
GND: GND.1 GND#2.1 LED1.3 LED1.8 LED2.3 LED2.8 Q3.3 Q4.3 Q5.3 Q6.3 U2.7 U3.7 U4.3 U4.8 U5.8 U7.8 U8.7 U9.3 U9.8 U10.8 U11.7 U12.7 U14.1 U15.1 U16.8 U17.1
D1: D.1 U2.2 U2.6 U5.11
$1N13452: CLK.1 U11.2

Pads without a net: LED1 5; LED2 5; U2 8 9 10 11 12 13; U5 3 4 5 6; U7 4 12; U8 3 4 5 6 8 9 10 11 12 13; U10 4 12; U11 4 5 6 8 9 10 11 12 13; U12 4 5 6 8 9 10 11 12 13; U16 3 4 5 6

## Via types
v1: diameter 0.508, hole 0.305, Top Layer to Bottom Layer, 11 vias

## Routing (per net, layer and track width the routed paths; a pad name or vN(x,y) marks a point on that pad's centre or on a via; arc(x,y) is an arc through that point)
VCC: length 349.2
  Top Layer w0.762: U2.1 U3.14 ; U8.14 53.97,40.2 55.75,41.98 55.75,57.98 53.81,59.93 R17.2 R18.2 R15.2 R16.2 24.72,59.89 U16.16 13.24,59.92 U17.2 ; U14.3 18.01,15.72 19.15,14.57 27.94,14.57 ; 27.94,14.57 U12.14 27.94,8.58 U11.14 ; 27.94,14.57 27.94,16.58 29.08,17.72 U15.3 33.09,15.72 SW3.6 SW3.3
  Bottom Layer w0.762: U4.4 63.88,32.33 ; U4.4 U4.5 ; U4.4 U7.5 63.88,23.18 64.77,22.3 72.14,22.3 74.04,20.39 U7.16 ; 63.88,32.33 57.15,32.33 56.26,33.22 U4.16 56.26,39.31 55.37,40.2 U8.14 50.04,42.49 41.78,42.49 U2.14 35.72,40.2 ; 63.88,32.33 76.58,32.33 ; U2.1 35.72,40.2 ; 35.72,40.2 35.72,32.58 ; U5.16 U5.1 3.68,40.2 2.29,41.6 2.29,58.36 3.81,59.89 U16.1 U16.16 ; 35.72,32.58 35.72,25.12 31.09,20.49 U15.3 ; 35.72,32.58 U2.4 ; 76.58,32.33 83.06,32.33 84.2,31.19 U9.4 ; 76.58,32.33 U9.16 ; U9.4 86.74,29.66 ; U9.4 U10.5 84.2,23.18 85.09,22.3 93.34,22.3 94.36,21.28 94.36,7.94 91.69,5.28 SW2.1 SW2.2 SW2.3 SW2.4 SW1.1 SW1.2 SW1.3 SW1.4
A1: length 25.2
  Top Layer w0.254: v1(11.43,26.49) 11.43,37.28 11.81,37.66 U5.15
  Bottom Layer w0.254: U5.15 15.62,37.66 U3.1 ; U5.7 9.91,24.96 v1(11.43,26.49)
A2: length 6
  Bottom Layer w0.254: U5.14 15.62,35.12 U3.4
A3: length 15.9
  Bottom Layer w0.254: U5.13 15.37,32.58 16.64,31.31 22.61,31.31 23.37,30.55 23.37,28.39 24.26,27.5 U3.9
A4: length 32.6
  Top Layer w0.254: U3.12 23.75,35.12 22.73,34.11 v1(22.73,30.04) ; v1(9.52,30.04) 9.52,36.52 8.38,37.66 U5.2
  Bottom Layer w0.254: v1(22.73,30.04) 21.59,28.9 16.64,28.9 15.49,30.04 U5.12 v1(9.52,30.04)
B1: length 38
  Bottom Layer w0.254: 10.08,45.92 10.08,56 11.43,57.35 U16.15 ; 10.08,45.92 6.86,45.92 5.59,44.65 ; 10.08,45.92 18.92,45.92 20.19,44.65 20.19,38.42 19.43,37.66 U3.2
B2: length 55.1
  Top Layer w0.254: v1(16.76,26.11) 16.76,28.65 U3.5
  Bottom Layer w0.254: v1(16.76,26.11) 27.05,26.11 28.83,27.88 28.83,41.43 27.51,42.74 23.11,42.74 21.97,43.89 21.97,49.09 16.26,54.81 U16.14
B3: length 35.6
  Bottom Layer w0.254: U3.10 27.3,30.04 28.19,30.93 28.19,41 26.96,42.23 22.73,42.23 21.34,43.63 21.34,48.84 17.91,52.27 U16.13
B4: length 37.3
  Top Layer w0.254: U16.2 6.98,57.35 7.75,56.59 7.75,50.62 8.64,49.73 U16.12
  Bottom Layer w0.254: U16.12 19.43,49.73 20.83,48.33 20.83,39.06 22.22,37.66 U3.13
CLK: length 79.6
  Bottom Layer w0.254: 28.07,14.17 20.83,14.17 U11.3 ; 28.07,14.17 28.07,26.11 29.46,27.5 29.46,34.23 30.35,35.12 U2.3 ; 28.07,14.17 40,14.17 41.15,15.31 41.15,16.83 42.16,17.85 51.69,17.85 53.47,19.63 67.94,19.63 68.96,18.61 U7.14
D1: length 65.5
  Top Layer w0.254: 29.72,21.66 29.72,26.61 30.61,27.5 U2.6 33.53,27.5 34.29,28.26 34.29,36.65 33.27,37.66 U2.2 ; 29.72,21.66 44.45,21.66 45.47,20.64 45.47,16.45 46.23,15.69 D.1 ; 29.72,21.66 17.02,21.66 15.62,23.06 15.62,26.87 14.99,27.5 U5.11
OUT1: length 21.8
  Top Layer w0.762: Q3.2 24.81,49.47 R16.1
  Bottom Layer w0.762: R16.1 21.87,52.32 U18.2
OUT2: length 23.7
  Top Layer w0.762: Q4.2 32.81,49.47 R15.1
  Bottom Layer w0.762: R15.1 32.77,53.92 27.94,58.74 27.94,62.78 U18.1
OUT3: length 28.1
  Top Layer w0.762: R18.1 40.81,49.47 45.46,49.47
  Bottom Layer w0.762: U19.2 30.51,58.46 33.53,55.44 38.99,55.44 40.77,53.66 R18.1
OUT4: length 29.5
  Top Layer w0.762: Q6.2 48.81,49.47 R17.1
  Bottom Layer w0.762: U19.1 36.19,63.16 36.19,60.14 41.53,54.81 46.23,54.81 48.77,52.27 R17.1
Q1: length 49.4
  Top Layer w0.254: U2.5 29.72,30.04 29.08,29.41 29.08,23.31 27.94,22.17 17.27,22.17 16.13,23.31 16.13,46.43 15.37,47.19 U16.11
S0: length 29.2
  Top Layer w0.254: U16.9 11.18,42.11 10.16,41.09 10.16,23.57 11.3,22.42 U5.9 U14.2
S1: length 41.7
  Top Layer w0.254: U15.2 26.29,20.26 25.4,21.15 16.76,21.15 15.11,22.8 15.11,24.33 14.48,24.96 U5.10 11.81,24.96 10.79,25.98 10.79,40.84 v1(11.43,41.47)
  Bottom Layer w0.254: v1(11.43,41.47) 11.43,44.14 11.94,44.65 13.21,44.65
Y1: length 21.5
  Top Layer w0.254: U3.3 19.56,35.12 20.57,36.14 20.57,45.28 22.22,46.93 Q3.1
Y2: length 35.7
  Top Layer w0.254: U3.6 19.68,27.5 21.08,28.9 21.08,43.12 22.35,44.39 30.48,44.39 33.02,46.93 Q4.1
Y3: length 46.5
  Top Layer w0.254: 45.46,46.93 41.66,46.93 38.61,43.89 22.86,43.89 21.59,42.62 21.59,26.74 23.37,24.96 U3.8
Y4: length 47.8
  Top Layer w0.254: Q6.1 49.02,46.93 45.34,43.25 24.38,43.25 23.49,42.36 23.49,40.08 24.64,38.93 27.56,38.93 28.7,37.79 28.7,33.6 27.69,32.58 U3.11
$1N3492: length 32.1
  Top Layer w0.254: LED1.7 79.63,62.43 77.09,59.89 66.93,59.89 63.63,56.59 R1.2
$1N3494: length 5.4
  Bottom Layer w0.254: LED1.1 74.8,53.66 R5.2
$1N3496: length 5.3
  Top Layer w0.254: R4.2 74.55,54.72 LED1.2
$1N3498: length 15.9
  Bottom Layer w0.254: R3.2 71.04,50.36 75.95,50.36 76.71,51.12 76.71,53.23 77.4,53.92 78.74,53.92 79.63,54.81 LED1.4
$1N3500: length 31.9
  Top Layer w0.254: R2.2 66.42,56.84 68.45,58.87 78.49,58.87 82.17,62.55 82.17,71.7
$1N3502: length 30.8
  Bottom Layer w0.254: LED1.9 74.55,61.16 71.37,57.98 63.84,57.98 R6.2
$1N3504: length 26.9
  Top Layer w0.254: R7.2 60.83,56.33 65.28,60.78 69.98,60.78 72.01,62.81 LED1.10
$1N3506: length 4.5
  Bottom Layer w0.254: U4.13 63.88,41.43 R1.1
$1N3508: length 4.7
  Bottom Layer w0.254: U4.9 74.04,40.92 R5.1
$1N3510: length 4.6
  Bottom Layer w0.254: R4.1 71.5,41.18 U4.10
$1N3512: length 4.5
  Bottom Layer w0.254: R3.1 68.96,41.43 U4.11
$1N3514: length 4.4
  Bottom Layer w0.254: U4.12 R2.1
$1N3516: length 4.6
  Bottom Layer w0.254: U4.14 61.34,41.18 R7.1
$1N3518: length 4.7
  Bottom Layer w0.254: R6.1 58.8,40.92 U4.15
$1N4737: length 4.7
  Top Layer w0.254: U4.2 U7.7
$1N4741: length 11.4
  Top Layer w0.254: U7.6 61.34,26.23 61.98,26.87 67.94,26.87 68.96,27.88 U4.6
$1N4746: length 26.4
  Top Layer w0.254: U4.1 54.86,29.66 54.23,29.03 54.23,23.95 54.99,23.18 70.99,23.18 71.5,23.69 U7.2
$1N4751: length 6.5
  Top Layer w0.254: U7.3 68.96,26.36 69.6,26.99 70.87,26.99 71.5,27.63 U4.7
$1N5070: length 57.8
  Top Layer w0.254: 61.34,20.01 52.32,20.01 50.55,21.79 50.55,35.76 48.64,37.66 U8.2 ; 61.34,20.01 U7.11 ; 61.34,20.01 v1(81.66,20.01)
  Bottom Layer w0.254: v1(81.66,20.01) U10.11
$1N5072: length 25.1
  Bottom Layer w0.254: SW1.6 62.86,14.42 74.17,14.42 75.44,15.69 75.44,20.52 74.04,21.91 U7.1
$1N5074: length 4.4
  Top Layer w0.254: U7.9 SW1.8
$1N5076: length 4.4
  Top Layer w0.254: U7.10 SW1.7
$1N5078: length 11.6
  Top Layer w0.254: SW1.5 v1(63.88,15.06)
  Bottom Layer w0.254: v1(63.88,15.06) 70.74,15.06 71.5,15.82 U7.15
$1N5761: length 4.7
  Bottom Layer w0.254: 79.12,37.28 79.12,40.92 R13.1
$1N5762: length 4.6
  Bottom Layer w0.254: R14.1 81.66,41.18 U9.14
$1N5763: length 4.7
  Bottom Layer w0.254: 94.36,37.28 94.36,40.92 R12.1
$1N5764: length 4.5
  Bottom Layer w0.254: U9.11 89.28,41.43 R10.1
$1N5765: length 4.6
  Bottom Layer w0.254: U9.10 91.82,41.18 R11.1
$1N5766: length 4.4
  Bottom Layer w0.254: 86.74,37.28 R9.1
$1N5767: length 4.5
  Bottom Layer w0.254: U9.13 84.2,41.43 R8.1
$1N5768: length 25
  Top Layer w0.254: v1(83.82,54.81) 83.82,60.78 85.47,62.43 85.47,69.67 LED2.9
  Bottom Layer w0.254: v1(83.82,54.81) 80.98,54.81 R13.2
$1N5769: length 21.1
  Top Layer w0.254: R14.2 81.15,53.41 83.31,55.57 83.31,60.9 84.96,62.55 LED2.10
$1N5770: length 11.9
  Bottom Layer w0.254: LED2.1 86.87,54.55 92.75,54.55 R12.2
$1N5771: length 8.1
  Top Layer w0.254: LED2.2 v1(87.5,53.92)
  Bottom Layer w0.254: R11.2 90.59,53.92 v1(87.5,53.92)
$1N5772: length 5.5
  Top Layer w0.254: LED2.4 92.58,55.23 R10.2
$1N5773: length 23.1
  Top Layer w0.254: LED2.7 92.58,65.09 86.23,58.74 86.23,54.47 R8.2
$1N5774: length 23
  Top Layer w0.254: LED2.6 95.12,64.21 88.77,57.86 88.77,54.22 R9.2
$1N5787: length 4.4
  Top Layer w0.254: U10.9 SW2.8
$1N5789: length 11.5
  Top Layer w0.254: U10.15 91.82,15.95 90.93,15.06 v1(84.2,15.06)
  Bottom Layer w0.254: SW2.5 v1(84.2,15.06)
$1N5791: length 25.1
  Top Layer w0.254: 94.36,24.96 94.36,20.64 95.76,19.25 95.76,15.69 94.49,14.42 83.19,14.42 SW2.6
$1N5793: length 4.4
  Top Layer w0.254: 79.12,17.34 SW2.7
$1N5811: length 66.9
  Top Layer w0.254: U12.2 30.48,5.79 31.88,7.18 83.95,7.18 86.74,9.98 v1(86.74,13.53)
  Bottom Layer w0.254: 86.74,17.34 v1(86.74,13.53)
$1N5814: length 6.5
  Top Layer w0.254: U9.7 91.82,27.63 91.19,26.99 89.92,26.99 89.28,26.36 U10.3
$1N5816: length 24.5
  Top Layer w0.254: U10.2 91.82,23.69 91.31,23.18 76.2,23.18 75.31,24.07 75.31,26.36 76.58,27.63 U9.1
$1N5818: length 11.4
  Top Layer w0.254: U10.6 81.66,26.23 82.3,26.87 88.26,26.87 89.28,27.88 U9.6
$1N5820: length 4.7
  Top Layer w0.254: 79.12,29.66 79.12,24.96
$1N6469: length 75.3
  Top Layer w0.254: U10.14 89.28,18.61 88.52,19.37 67.06,19.37 66.42,18.74 U7.13 66.42,10.1 64.13,7.82 29.72,7.82 27.94,6.04 U12.1
$1N7655: length 15.9
  Bottom Layer w0.254: U12.3 33.02,5.91 32.13,6.8 24.64,6.8 23.62,7.82 U11.1
$1N11028: length 32.1
  Bottom Layer w0.762: SW3.1 SW3.2 ; SW3.1 SW3.4 SW3.5 ; SW3.1 41.91,22.05 41.91,39.19 42.93,40.2 U8.1
$1N13452: length 23.7
  Bottom Layer w0.254: U11.2 22.86,13.66 41.15,13.66 CLK.1

## Copper pours and planes (outline as drawn; the poured copper is in the pictures)
GND on Top Layer: -10.29,95.19 105.41,95.19 105.41,-19.61 -10.29,-19.61
GND on Bottom Layer: -8,84.91 111.63,84.91 111.63,-13.14 -8,-13.14

## Text on the board
Top Silkscreen Layer: VCC | GND | OUT1 | OUT2 | OUT3 | OUT4
